# Altium schematic sheet Sheet1.SchDoc (part 1 of 3)
size A2; SheetNumber: 3; SheetTotal: 3
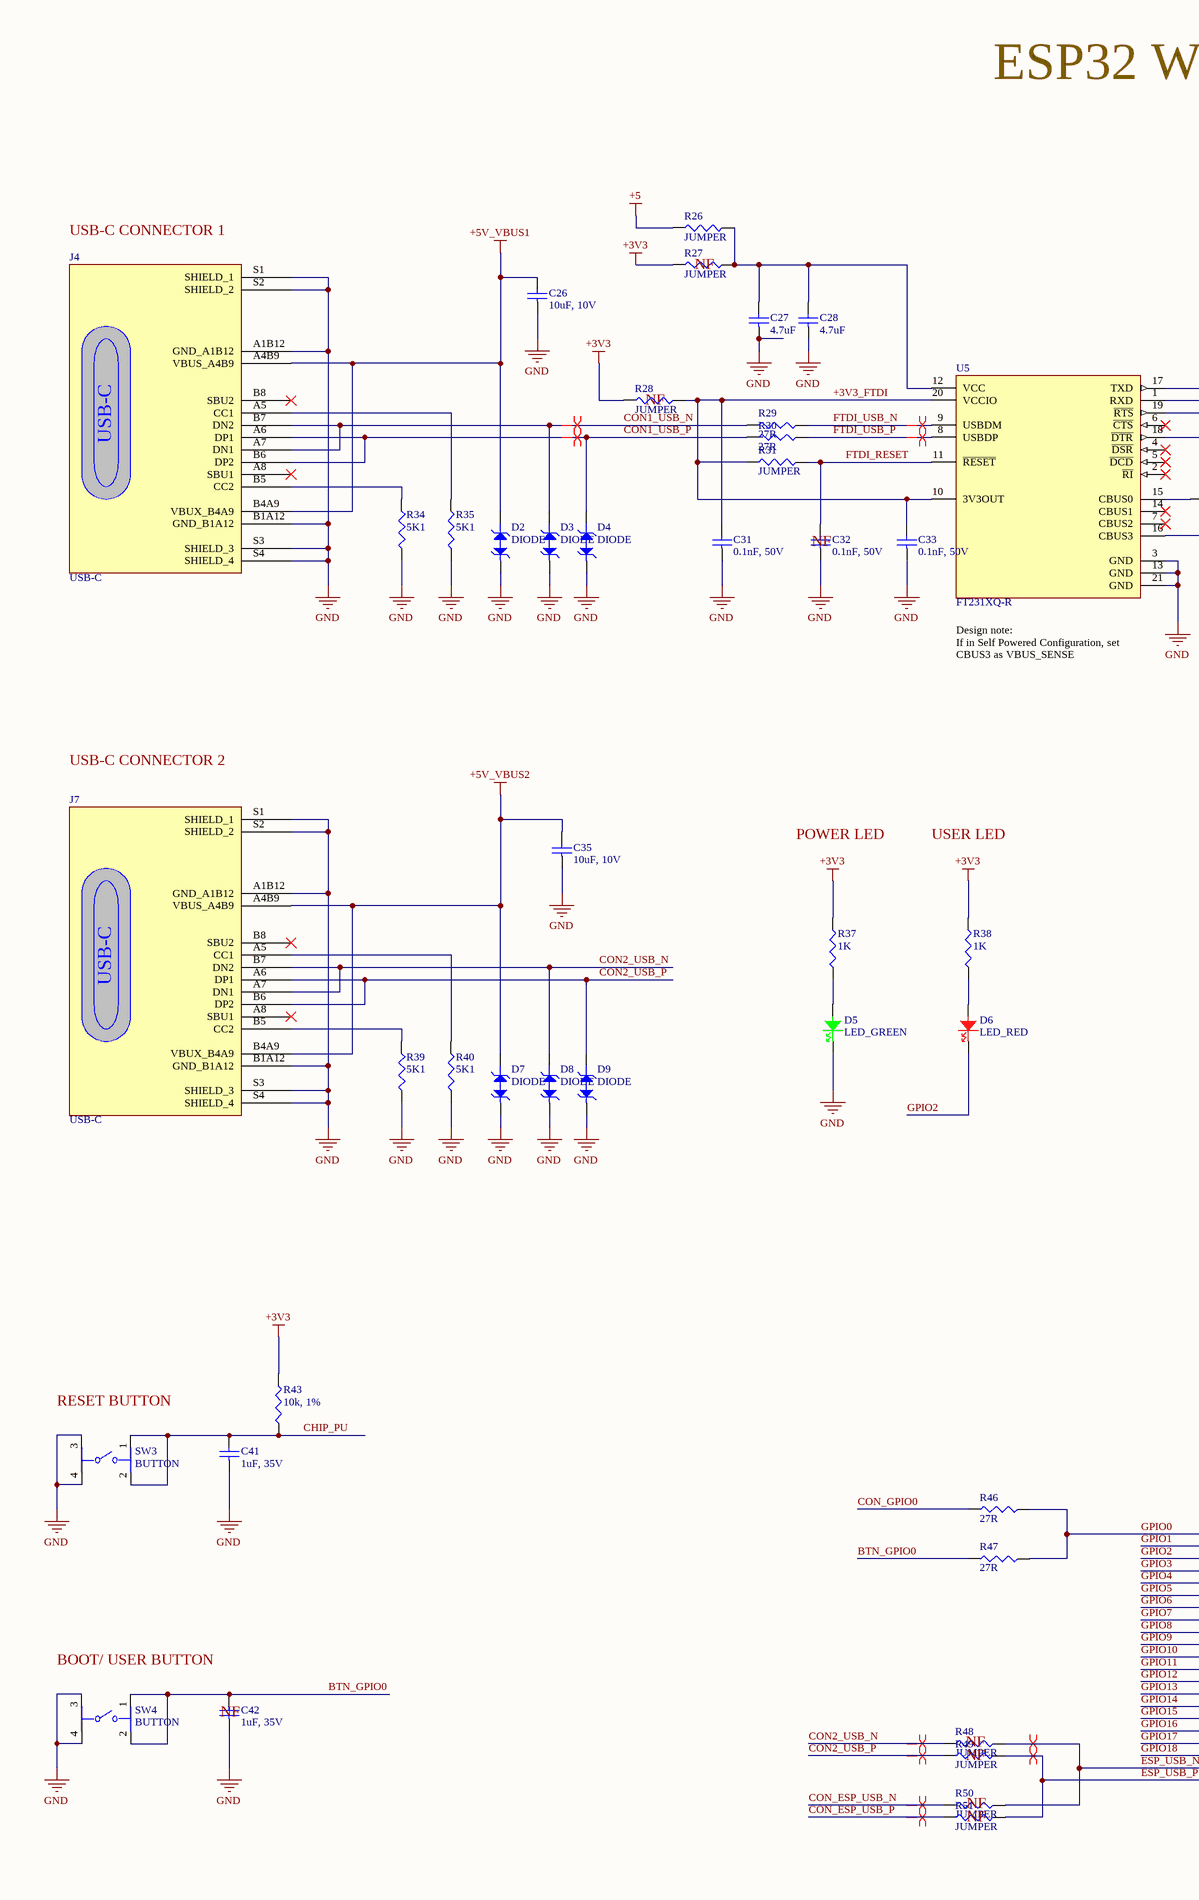
[diagram p0: Sheet1.SchDoc, left]
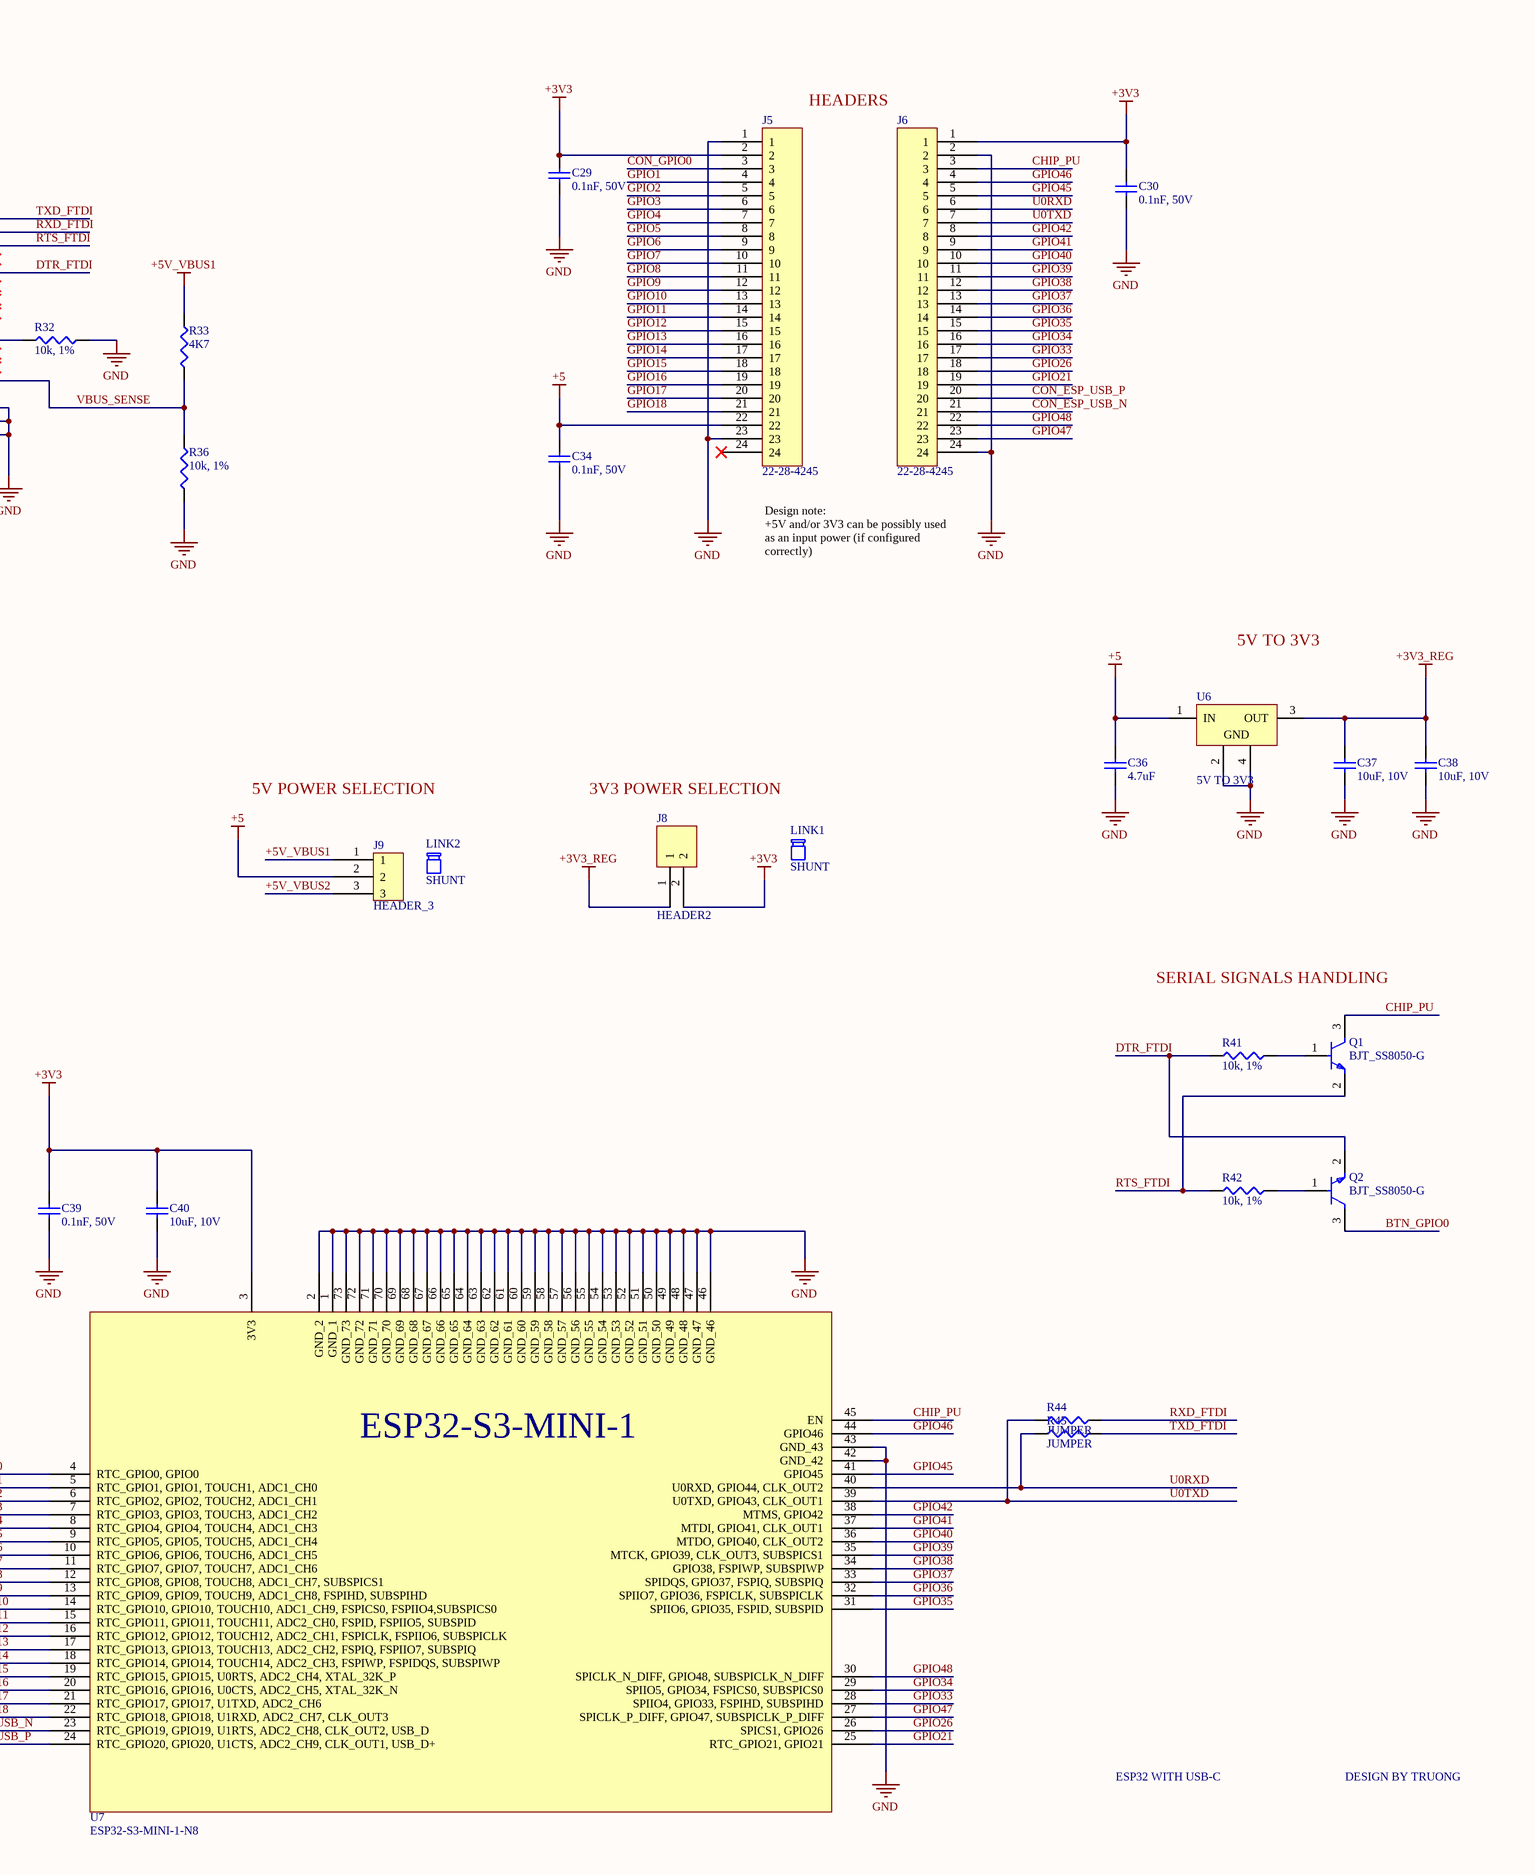
[diagram p1: Sheet1.SchDoc, right]

## Parts
C26  10uF, 10V  [CAPC1005X70N]
C27  4.7uF  [CAPC1005X70N]
C28  4.7uF  [CAPC1005X70N]
C29  0.1nF, 50V  [CAPC1005X70N]
C30  0.1nF, 50V  [CAPC1005X70N]
C31  0.1nF, 50V  [CAPC1005X70N]
C32  0.1nF, 50V  [CAPC1005X70N]
C33  0.1nF, 50V  [CAPC1005X70N]
C34  0.1nF, 50V  [CAPC1005X70N]
C35  10uF, 10V  [CAPC1005X70N]
C36  4.7uF  [CAPC1005X70N]
C37  10uF, 10V  [CAPC1005X70N]
C38  10uF, 10V  [CAPC1005X70N]
C39  0.1nF, 50V  [CAPC1005X70N]
C40  10uF, 10V  [CAPC1005X70N]
C41  1uF, 35V  [CAPC1005X70N]
C42  1uF, 35V  [CAPC1005X70N]
D2  DIODE  [SOD882]
D3  DIODE  [SOD882]
D4  DIODE  [SOD882]
D5  LED_GREEN  [LED0402_GREEN]
D6  LED_RED  [LED0402_RED]
D7  DIODE  [SOD882]
D8  DIODE  [SOD882]
D9  DIODE  [SOD882]
J4  USB-C  [FP-2171790001-MFG]
J5  22-28-4245  [HDR_1X24_2.55MM]
J6  22-28-4245  [HDR_1X24_2.55MM]
J7  USB-C  [FP-2171790001-MFG]
J8  HEADER2  [HDR_1X2_1.27MM]
J9  HEADER_3  [HDR_1X3_1.27MM]
LINK1  SHUNT  (mechanical)
LINK2  SHUNT  (mechanical)
Q1  BJT_SS8050-G  [FP-SS8050-G-IPC_B]
Q2  BJT_SS8050-G  [FP-SS8050-G-IPC_B]
R26  JUMPER  [RESC1005X40N]
R27  JUMPER  [RESC1005X40N]
R28  JUMPER  [RESC1005X40N]
R29  27R  [RESC1005X40N]
R30  27R  [RESC1005X40N]
R31  JUMPER  [RESC1005X40N]
R32  10k, 1%  [RESC1005X40N]
R33  4K7  [RESC1005X40N]
R34  5K1  [RESC1005X40N]
R35  5K1  [RESC1005X40N]
R36  10k, 1%  [RESC1005X40N]
R37  1K  [RESC1005X40N]
R38  1K  [RESC1005X40N]
R39  5K1  [RESC1005X40N]
R40  5K1  [RESC1005X40N]
R41  10k, 1%  [RESC1005X40N]
R42  10k, 1%  [RESC1005X40N]
R43  10k, 1%  [RESC1005X40N]
R44  JUMPER  [RESC1005X40N]
R45  JUMPER  [RESC1005X40N]
R46  27R  [RESC1005X40N]
R47  27R  [RESC1005X40N]
R48  JUMPER  [RESC1005X40N]
R49  JUMPER  [RESC1005X40N]
R50  JUMPER  [RESC1005X40N]
R51  JUMPER  [RESC1005X40N]
SW3  BUTTON  [FP-PTS645SM43SMTR92LFS-MFG]
SW4  BUTTON  [FP-PTS645SM43SMTR92LFS-MFG]
U5  FT231XQ-R  [FP-QFN-20-IPC_B]
U6  5V TO 3V3  [DCY0004A_N]
U7  ESP32-S3-MINI-1-N8  [XCVR_ESP32-S3-MINI-1-N8]

## Nets
+3V3: C29.2 C30.2 C39.2 C40.2 J5.2 J6.1 J8.2 R27.1 R28.1 R37.2 R38.2 R43.2 U7.3(3V3)
+3V3_REG: C37.2 C38.2 J8.1 U6.3(OUT)
+5: C34.2 C36.2 J5.22 J9.2 R26.1 U6.1(IN)
+5V_VBUS1: C26.2 D2.2 J4.A4B9(VBUS_A4B9) J4.B4A9(VBUX_B4A9) J9.1 R33.2
+5V_VBUS2: C35.2 D7.2 J7.A4B9(VBUS_A4B9) J7.B4A9(VBUX_B4A9) J9.3
GND: C26.1 C27.1 C28.1 C29.1 C30.1 C31.1 C32.1 C33.1 C34.1 C35.1 C36.1 C37.1 C38.1 C39.1 C40.1 C41.1 C42.1 D2.1 D3.1 D4.1 D5.1 D7.1 D8.1 D9.1 J4.A1B12(GND_A1B12) J4.B1A12(GND_B1A12) J4.S1(SHIELD_1) J4.S2(SHIELD_2) J4.S3(SHIELD_3) J4.S4(SHIELD_4) J5.1 J5.23 J6.2 J6.24 J7.A1B12(GND_A1B12) J7.B1A12(GND_B1A12) J7.S1(SHIELD_1) J7.S2(SHIELD_2) J7.S3(SHIELD_3) J7.S4(SHIELD_4) R32.2 R34.2 R35.2 R36.1 R39.2 R40.2 SW3.3 SW3.4 SW4.3 SW4.4 U5.3(GND) U5.13(GND) U5.21(GND) U6.2(GND) U6.4(GND) U7.1(GND_1) U7.2(GND_2) U7.42(GND_42) U7.43(GND_43) U7.46(GND_46) U7.47(GND_47) U7.48(GND_48) U7.49(GND_49) U7.50(GND_50) U7.51(GND_51) U7.52(GND_52) U7.53(GND_53) U7.54(GND_54) U7.55(GND_55) U7.56(GND_56) U7.57(GND_57) U7.58(GND_58) U7.59(GND_59) U7.60(GND_60) U7.61(GND_61) U7.62(GND_62) U7.63(GND_63) U7.64(GND_64) U7.65(GND_65) U7.66(GND_66) U7.67(GND_67) U7.68(GND_68) U7.69(GND_69) U7.70(GND_70) U7.71(GND_71) U7.72(GND_72) U7.73(GND_73)
+3V3_FTDI: C31.2 C33.2 R28.2 R31.1 U5.10(3V3OUT) U5.20(VCCIO)
BTN_GPIO0: C42.2 Q2.3(C) R47.1 SW4.1 SW4.2
CHIP_PU: C41.2 J6.3 Q1.3(C) R43.1 SW3.1 SW3.2 U7.45(EN)
CON1_USB_N: D3.2 J4.A7(DN1) J4.B7(DN2) R29.1
CON1_USB_P: D4.2 J4.A6(DP1) J4.B6(DP2) R30.1
CON2_USB_N: D8.2 J7.A7(DN1) J7.B7(DN2) R48.1
CON2_USB_P: D9.2 J7.A6(DP1) J7.B6(DP2) R49.1
CON_ESP_USB_N: J6.21 R50.1
CON_ESP_USB_P: J6.20 R51.1
CON_GPIO0: J5.3 R46.1
DTR_FTDI: Q2.2(E) R41.1 U5.18(~{DTR})
ESP_USB_N: R48.2 R50.2 U7.23(RTC_GPIO19,_GPIO19,_U1RTS,_ADC2_CH8,_CLK_OUT2,_USB_D)
ESP_USB_P: R49.2 R51.2 U7.24(RTC_GPIO20,_GPIO20,_U1CTS,_ADC2_CH9,_CLK_OUT1,_USB_D+)
FTDI_RESET: C32.2 R31.2 U5.11(~{RESET})
FTDI_USB_N: R29.2 U5.9(USBDM)
FTDI_USB_P: R30.2 U5.8(USBDP)
GPIO0: R46.2 R47.2 U7.4(RTC_GPIO0,_GPIO0)
GPIO1: J5.4 U7.5(RTC_GPIO1,_GPIO1,_TOUCH1,_ADC1_CH0)
GPIO2: D6.1 J5.5 U7.6(RTC_GPIO2,_GPIO2,_TOUCH2,_ADC1_CH1)
GPIO3: J5.6 U7.7(RTC_GPIO3,_GPIO3,_TOUCH3,_ADC1_CH2)
GPIO4: J5.7 U7.8(RTC_GPIO4,_GPIO4,_TOUCH4,_ADC1_CH3)
GPIO5: J5.8 U7.9(RTC_GPIO5,_GPIO5,_TOUCH5,_ADC1_CH4)
GPIO6: J5.9 U7.10(RTC_GPIO6,_GPIO6,_TOUCH6,_ADC1_CH5)
GPIO7: J5.10 U7.11(RTC_GPIO7,_GPIO7,_TOUCH7,_ADC1_CH6)
GPIO8: J5.11 U7.12(RTC_GPIO8,_GPIO8,_TOUCH8,_ADC1_CH7,_SUBSPICS1)
GPIO9: J5.12 U7.13(RTC_GPIO9,_GPIO9,_TOUCH9,_ADC1_CH8,_FSPIHD,_SUBSPIHD)
GPIO10: J5.13 U7.14(RTC_GPIO10,_GPIO10,_TOUCH10,_ADC1_CH9,_FSPICS0,_FSPIIO4,SUBSPICS0)
GPIO11: J5.14 U7.15(RTC_GPIO11,_GPIO11,_TOUCH11,_ADC2_CH0,_FSPID,_FSPIIO5,_SUBSPID)
GPIO12: J5.15 U7.16(RTC_GPIO12,_GPIO12,_TOUCH12,_ADC2_CH1,_FSPICLK,_FSPIIO6,_SUBSPICLK)
GPIO13: J5.16 U7.17(RTC_GPIO13,_GPIO13,_TOUCH13,_ADC2_CH2,_FSPIQ,_FSPIIO7,_SUBSPIQ)
GPIO14: J5.17 U7.18(RTC_GPIO14,_GPIO14,_TOUCH14,_ADC2_CH3,_FSPIWP,_FSPIDQS,_SUBSPIWP)
GPIO15: J5.18 U7.19(RTC_GPIO15,_GPIO15,_U0RTS,_ADC2_CH4,_XTAL_32K_P)
GPIO16: J5.19 U7.20(RTC_GPIO16,_GPIO16,_U0CTS,_ADC2_CH5,_XTAL_32K_N)
GPIO17: J5.20 U7.21(RTC_GPIO17,_GPIO17,_U1TXD,_ADC2_CH6)
GPIO18: J5.21 U7.22(RTC_GPIO18,_GPIO18,_U1RXD,_ADC2_CH7,_CLK_OUT3)
GPIO21: J6.19 U7.25(RTC_GPIO21,_GPIO21)
GPIO26: J6.18 U7.26(SPICS1,_GPIO26)
GPIO33: J6.17 U7.28(SPIIO4,_GPIO33,_FSPIHD,_SUBSPIHD)
GPIO34: J6.16 U7.29(SPIIO5,_GPIO34,_FSPICS0,_SUBSPICS0)
GPIO35: J6.15 U7.31(SPIIO6,_GPIO35,_FSPID,_SUBSPID)
GPIO36: J6.14 U7.32(SPIIO7,_GPIO36,_FSPICLK,_SUBSPICLK)
GPIO37: J6.13 U7.33(SPIDQS,_GPIO37,_FSPIQ,_SUBSPIQ)
GPIO38: J6.12 U7.34(GPIO38,_FSPIWP,_SUBSPIWP)
GPIO39: J6.11 U7.35(MTCK,_GPIO39,_CLK_OUT3,_SUBSPICS1)
GPIO40: J6.10 U7.36(MTDO,_GPIO40,_CLK_OUT2)
GPIO41: J6.9 U7.37(MTDI,_GPIO41,_CLK_OUT1)
GPIO42: J6.8 U7.38(MTMS,_GPIO42)
GPIO45: J6.5 U7.41(GPIO45)
GPIO46: J6.4 U7.44(GPIO46)
GPIO47: J6.23 U7.27(SPICLK_P_DIFF,_GPIO47,_SUBSPICLK_P_DIFF)
GPIO48: J6.22 U7.30(SPICLK_N_DIFF,_GPIO48,_SUBSPICLK_N_DIFF)
RTS_FTDI: Q1.2(E) R42.1 U5.19(~{RTS})
RXD_FTDI: R44.2 U5.1(RXD)
TXD_FTDI: R45.2 U5.17(TXD)
U0RXD: J6.6 R45.1 U7.40(U0RXD,_GPIO44,_CLK_OUT2)
U0TXD: J6.7 R44.1 U7.39(U0TXD,_GPIO43,_CLK_OUT1)
VBUS_SENSE: R33.1 R36.2 U5.16(CBUS3)
NetC27_2: C27.2 C28.2 R26.2 R27.2 U5.12(VCC)
NetD5_2: D5.2 R37.1
NetD6_2: D6.2 R38.1
NetJ4_A5: J4.A5(CC1) R35.1
NetJ4_B5: J4.B5(CC2) R34.1
NetJ7_A5: J7.A5(CC1) R40.1
NetJ7_B5: J7.B5(CC2) R39.1
NetQ1_1: Q1.1(B) R41.2
NetQ2_1: Q2.1(B) R42.2
NetR32_1: R32.1 U5.15(CBUS0)

Not connected (* = marked no-connect by the designer): J4 A8(SBU1)* B8(SBU2)*; J5 24*; J7 A8(SBU1)* B8(SBU2)*; U5 2(~{RI})* 4(~{DSR})* 5(~{DCD})* 6(~{CTS})* 7(CBUS2)* 14(CBUS1)*

## Layout directives
differential pair; differential pair class DIFF90: CON1_USB_N, CON1_USB_P, CON2_USB_N, CON2_USB_P, CON_ESP_USB_N, CON_ESP_USB_P, ESP_USB_N, ESP_USB_P, FTDI_USB_N, FTDI_USB_P

## Notes on the sheet
- ESP32 WITH USB-C
- USB-C CONNECTOR 1
- (near R27) NF
- HEADERS
- (near R28) NF
- (near C32) NF
- (near U5) Design note:
  If in Self Powered Configuration, set CBUS3 as VBUS_SENSE
- Design note:
  +5V and/or 3V3 can be possibly used as an input power (if configured correctly)
- USB-C CONNECTOR 2
- 5V TO 3V3
- POWER LED
- USER LED
- 5V POWER SELECTION
- 3V3 POWER SELECTION
- SERIAL SIGNALS HANDLING
- RESET BUTTON
- BOOT/ USER BUTTON
- (near C42) NF
- (near R48) NF
- (near R49) NF
- (near R50) NF
- (near R51) NF
- DESIGN BY TRUONG
- (in symbol ESP32-S3-MINI-1-N8 (2)) ESP32-S3-MINI-1